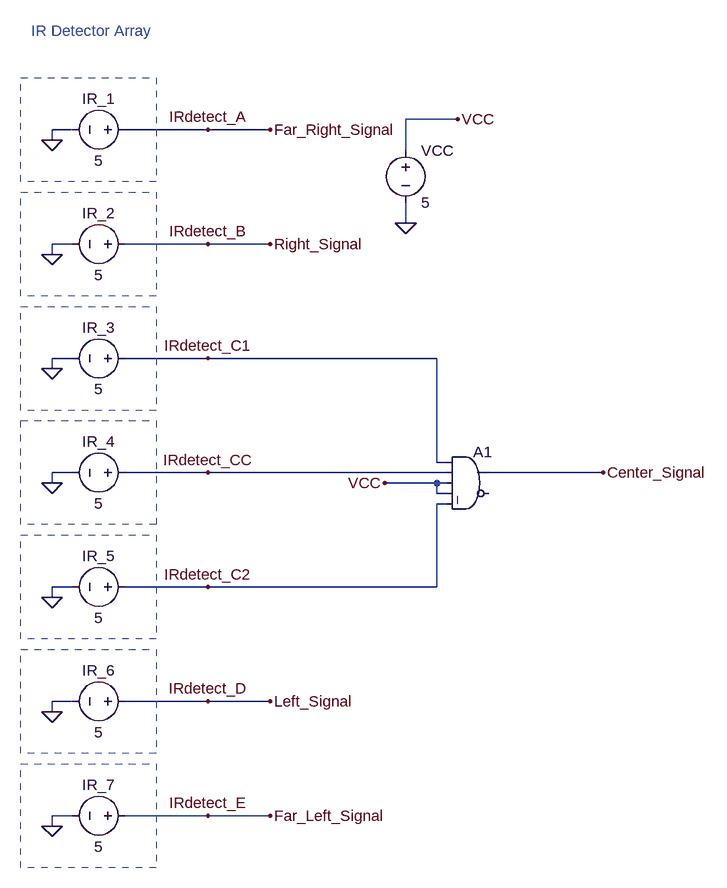
[diagram p0: schematic IR_Rx.asc]
IR_Rx.asc, the LTspice schematic file:
Version 4
SHEET 1 880 680
WIRE -31568 -31568 -31648 -31568
WIRE -32160 -31552 -32192 -31552
WIRE -31952 -31552 -32080 -31552
WIRE -31856 -31552 -31952 -31552
WIRE -32192 -31536 -32192 -31552
WIRE -31648 -31520 -31648 -31568
WIRE -31648 -31408 -31648 -31440
WIRE -32160 -31376 -32192 -31376
WIRE -31952 -31376 -32080 -31376
WIRE -31856 -31376 -31952 -31376
WIRE -32192 -31360 -32192 -31376
WIRE -32160 -31200 -32192 -31200
WIRE -31952 -31200 -32080 -31200
WIRE -31600 -31200 -31952 -31200
WIRE -32192 -31184 -32192 -31200
WIRE -31600 -31040 -31600 -31200
WIRE -31584 -31040 -31600 -31040
WIRE -32160 -31024 -32192 -31024
WIRE -31952 -31024 -32080 -31024
WIRE -31584 -31024 -31952 -31024
WIRE -31344 -31024 -31520 -31024
WIRE -32192 -31008 -32192 -31024
WIRE -31600 -31008 -31680 -31008
WIRE -31584 -31008 -31600 -31008
WIRE -31600 -30992 -31600 -31008
WIRE -31584 -30992 -31600 -30992
WIRE -31584 -30976 -31600 -30976
WIRE -32160 -30848 -32192 -30848
WIRE -31952 -30848 -32080 -30848
WIRE -31600 -30848 -31600 -30976
WIRE -31600 -30848 -31952 -30848
WIRE -32192 -30832 -32192 -30848
WIRE -32160 -30672 -32192 -30672
WIRE -31952 -30672 -32080 -30672
WIRE -31856 -30672 -31952 -30672
WIRE -32192 -30656 -32192 -30672
WIRE -32160 -30496 -32192 -30496
WIRE -31952 -30496 -32080 -30496
WIRE -31856 -30496 -31952 -30496
WIRE -32192 -30480 -32192 -30496
FLAG -31952 -31552 IRdetect_A
FLAG -32192 -31536 0
FLAG -31952 -31376 IRdetect_B
FLAG -32192 -31360 0
FLAG -31952 -31200 IRdetect_C1
FLAG -32192 -31184 0
FLAG -31952 -31024 IRdetect_CC
FLAG -32192 -31008 0
FLAG -31952 -30848 IRdetect_C2
FLAG -32192 -30832 0
FLAG -31952 -30672 IRdetect_D
FLAG -32192 -30656 0
FLAG -31952 -30496 IRdetect_E
FLAG -32192 -30480 0
FLAG -31648 -31408 0
FLAG -31568 -31568 VCC
FLAG -31680 -31008 VCC
FLAG -31344 -31024 Center_Signal
FLAG -31856 -30672 Left_Signal
FLAG -31856 -30496 Far_Left_Signal
FLAG -31856 -31376 Right_Signal
FLAG -31856 -31552 Far_Right_Signal
SYMBOL voltage -32064 -31552 R90
WINDOW 0 -32 56 VBottom 2
WINDOW 3 32 56 VTop 2
SYMATTR InstName IR_1
SYMATTR Value 5
SYMBOL voltage -32064 -31376 R90
WINDOW 0 -32 56 VBottom 2
WINDOW 3 32 56 VTop 2
SYMATTR InstName IR_2
SYMATTR Value 5
SYMBOL voltage -32064 -31200 R90
WINDOW 0 -32 56 VBottom 2
WINDOW 3 32 56 VTop 2
SYMATTR InstName IR_3
SYMATTR Value 5
SYMBOL voltage -32064 -31024 R90
WINDOW 0 -32 56 VBottom 2
WINDOW 3 32 56 VTop 2
SYMATTR InstName IR_4
SYMATTR Value 5
SYMBOL voltage -32064 -30848 R90
WINDOW 0 -32 56 VBottom 2
WINDOW 3 32 56 VTop 2
SYMATTR InstName IR_5
SYMATTR Value 5
SYMBOL voltage -32064 -30672 R90
WINDOW 0 -32 56 VBottom 2
WINDOW 3 32 56 VTop 2
SYMATTR InstName IR_6
SYMATTR Value 5
SYMBOL voltage -32064 -30496 R90
WINDOW 0 -32 56 VBottom 2
WINDOW 3 32 56 VTop 2
SYMATTR InstName IR_7
SYMATTR Value 5
SYMBOL Digital\\and -31552 -31072 R0
SYMATTR InstName A1
SYMBOL voltage -31648 -31536 R0
SYMATTR InstName VCC
SYMATTR Value 5
TEXT -32224 -31704 Left 2 ;IR Detector Array
RECTANGLE Normal -32032 -31472 -32240 -31632 2
RECTANGLE Normal -32032 -31296 -32240 -31456 2
RECTANGLE Normal -32032 -31120 -32240 -31280 2
RECTANGLE Normal -32032 -30944 -32240 -31104 2
RECTANGLE Normal -32032 -30768 -32240 -30928 2
RECTANGLE Normal -32032 -30592 -32240 -30752 2
RECTANGLE Normal -32032 -30416 -32240 -30576 2

The netlist it stands for:
* IR_Rx.asc
V§IR_1 Far_Right_Signal 0 5
V§IR_2 Right_Signal 0 5
V§IR_3 IRdetect_C1 0 5
V§IR_4 IRdetect_CC 0 5
V§IR_5 IRdetect_C2 0 5
V§IR_6 Left_Signal 0 5
V§IR_7 Far_Left_Signal 0 5
A1 IRdetect_C1 IRdetect_CC VCC VCC IRdetect_C2 0 Center_Signal 0 AND
VCC VCC 0 5
* IR Detector Array
.backanno
.end